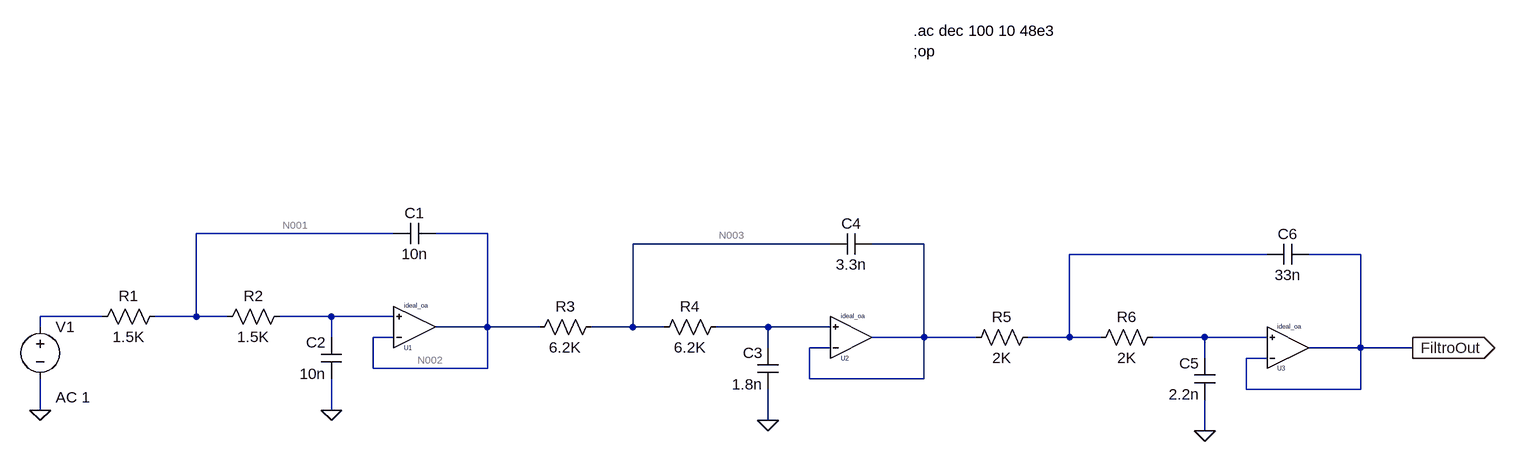
[diagram p0: schematic filtro_passa_baixa_gabriel_mendes.asc]
filtro_passa_baixa_gabriel_mendes.asc, the LTspice schematic file:
Version 4
SHEET 1 1292 1288
WIRE -1104 -528 -1408 -528
WIRE -960 -528 -1040 -528
WIRE -432 -512 -736 -512
WIRE -288 -512 -368 -512
WIRE 240 -496 -64 -496
WIRE 384 -496 304 -496
WIRE -1552 -400 -1648 -400
WIRE -1408 -400 -1408 -528
WIRE -1408 -400 -1472 -400
WIRE -1360 -400 -1408 -400
WIRE -1200 -400 -1280 -400
WIRE -1104 -400 -1200 -400
WIRE -1648 -384 -1648 -400
WIRE -960 -384 -960 -528
WIRE -960 -384 -1040 -384
WIRE -880 -384 -960 -384
WIRE -736 -384 -736 -512
WIRE -736 -384 -800 -384
WIRE -688 -384 -736 -384
WIRE -528 -384 -608 -384
WIRE -432 -384 -528 -384
WIRE -1200 -368 -1200 -400
WIRE -1104 -368 -1136 -368
WIRE -288 -368 -288 -512
WIRE -288 -368 -368 -368
WIRE -208 -368 -288 -368
WIRE -64 -368 -64 -496
WIRE -64 -368 -128 -368
WIRE -16 -368 -64 -368
WIRE 144 -368 64 -368
WIRE 240 -368 144 -368
WIRE -528 -352 -528 -384
WIRE -432 -352 -464 -352
WIRE 384 -352 384 -496
WIRE 384 -352 304 -352
WIRE 464 -352 384 -352
WIRE 144 -336 144 -368
WIRE 240 -336 208 -336
WIRE -1136 -320 -1136 -368
WIRE -960 -320 -960 -384
WIRE -960 -320 -1136 -320
WIRE -464 -304 -464 -352
WIRE -288 -304 -288 -368
WIRE -288 -304 -464 -304
WIRE 208 -288 208 -336
WIRE 384 -288 384 -352
WIRE 384 -288 208 -288
WIRE -1648 -256 -1648 -304
WIRE -1200 -256 -1200 -304
WIRE -528 -240 -528 -288
WIRE 144 -224 144 -272
FLAG -1648 -256 0
FLAG 464 -352 FiltroOut
IOPIN 464 -352 Out
FLAG -1200 -256 0
FLAG -528 -240 0
FLAG 144 -224 0
SYMBOL res -1456 -416 R90
WINDOW 0 0 56 VBottom 2
WINDOW 3 32 56 VTop 2
SYMATTR InstName R1
SYMATTR Value 1.5K
SYMBOL cap -1184 -304 R180
WINDOW 0 24 56 Left 2
WINDOW 3 24 8 Left 2
SYMATTR InstName C2
SYMATTR Value 10n
SYMBOL voltage -1648 -400 R0
WINDOW 123 24 124 Left 2
WINDOW 39 0 0 Left 0
SYMATTR Value2 AC 1
SYMATTR InstName V1
SYMATTR Value ""
SYMBOL ideal_oa -1088 -384 M180
SYMATTR InstName U1
SYMBOL cap -1040 -544 R90
WINDOW 0 0 32 VBottom 2
WINDOW 3 32 32 VTop 2
SYMATTR InstName C1
SYMATTR Value 10n
SYMBOL res -1264 -416 R90
WINDOW 0 0 56 VBottom 2
WINDOW 3 32 56 VTop 2
SYMATTR InstName R2
SYMATTR Value 1.5K
SYMBOL res -784 -400 R90
WINDOW 0 0 56 VBottom 2
WINDOW 3 32 56 VTop 2
SYMATTR InstName R3
SYMATTR Value 6.2K
SYMBOL cap -512 -288 R180
WINDOW 0 24 56 Left 2
WINDOW 3 24 8 Left 2
SYMATTR InstName C3
SYMATTR Value 1.8n
SYMBOL ideal_oa -416 -368 M180
SYMATTR InstName U2
SYMBOL cap -368 -528 R90
WINDOW 0 0 32 VBottom 2
WINDOW 3 32 32 VTop 2
SYMATTR InstName C4
SYMATTR Value 3.3n
SYMBOL res -592 -400 R90
WINDOW 0 0 56 VBottom 2
WINDOW 3 32 56 VTop 2
SYMATTR InstName R4
SYMATTR Value 6.2K
SYMBOL res -112 -384 R90
WINDOW 0 0 56 VBottom 2
WINDOW 3 32 56 VTop 2
SYMATTR InstName R5
SYMATTR Value 2K
SYMBOL cap 160 -272 R180
WINDOW 0 24 56 Left 2
WINDOW 3 24 8 Left 2
SYMATTR InstName C5
SYMATTR Value 2.2n
SYMBOL ideal_oa 256 -352 M180
SYMATTR InstName U3
SYMBOL cap 304 -512 R90
WINDOW 0 0 32 VBottom 2
WINDOW 3 32 32 VTop 2
SYMATTR InstName C6
SYMATTR Value 33n
SYMBOL res 80 -384 R90
WINDOW 0 0 56 VBottom 2
WINDOW 3 32 56 VTop 2
SYMATTR InstName R6
SYMATTR Value 2K
TEXT -304 -840 Left 2 !.ac dec 100 10 48e3\n;op

The netlist it stands for:
* filtro_passa_baixa_gabriel_mendes.asc
R1 N001 N006 1.5K
C2 0 N007 10n
V1 N006 0 AC 1
XU1 N007 N002 N002 ideal_oa Rin=1e9, Rout=1, A=1e9  ; pins p m out
C1 N002 N001 10n
R2 N007 N001 1.5K
R3 N003 N002 6.2K
C3 0 N008 1.8n
XU2 N008 N004 N004 ideal_oa Rin=1e9, Rout=1, A=1e9  ; pins p m out
C4 N004 N003 3.3n
R4 N008 N003 6.2K
R5 N005 N004 2K
C5 0 N009 2.2n
XU3 N009 FiltroOut FiltroOut ideal_oa Rin=1e9, Rout=1, A=1e9  ; pins p m out
C6 FiltroOut N005 33n
R6 N009 N005 2K
.ac dec 100 10 48e3
;op
.lib ece412.lib
.backanno
.end

* Results of the author's LTspice run, read from the files saved beside the schematic
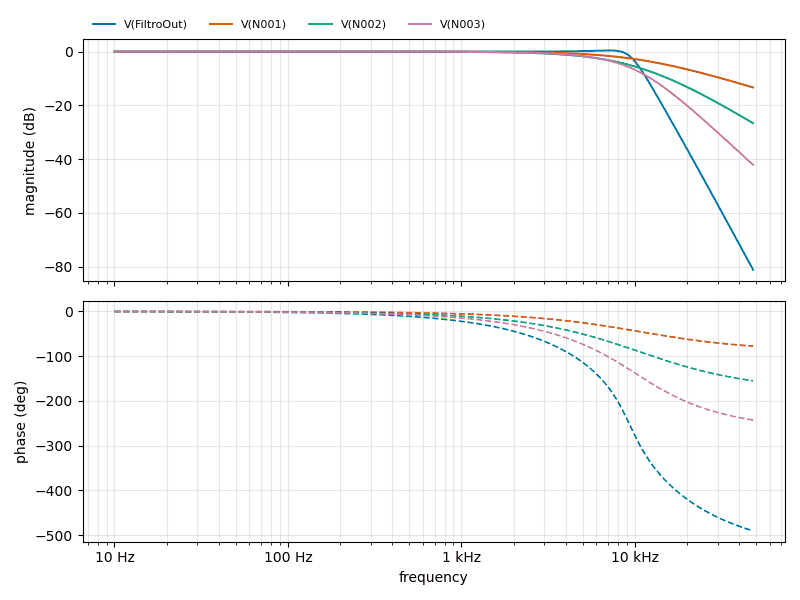
[diagram p1: AC Analysis of filtro_passa_baixa_gabriel_mendes.asc, plotted from the saved traces]
* AC Analysis, 1 run:
*   V(FiltroOut): 0.00 dB at 10 Hz, -81.18 dB at 48 kHz, peak 0.47 dB at 7.079 kHz, 3 dB below the peak at 9.648 kHz
*   V(N001): -0.00 dB at 10 Hz, -13.32 dB at 48 kHz, peak -0.00 dB at 10 Hz, 3 dB below the peak at 10.61 kHz
*   V(N002): -0.00 dB at 10 Hz, -26.63 dB at 48 kHz, peak -0.00 dB at 10 Hz, 3 dB below the peak at 6.828 kHz
*   V(N003): -0.00 dB at 10 Hz, -42.12 dB at 48 kHz, peak -0.00 dB at 10 Hz, 3 dB below the peak at 6.739 kHz